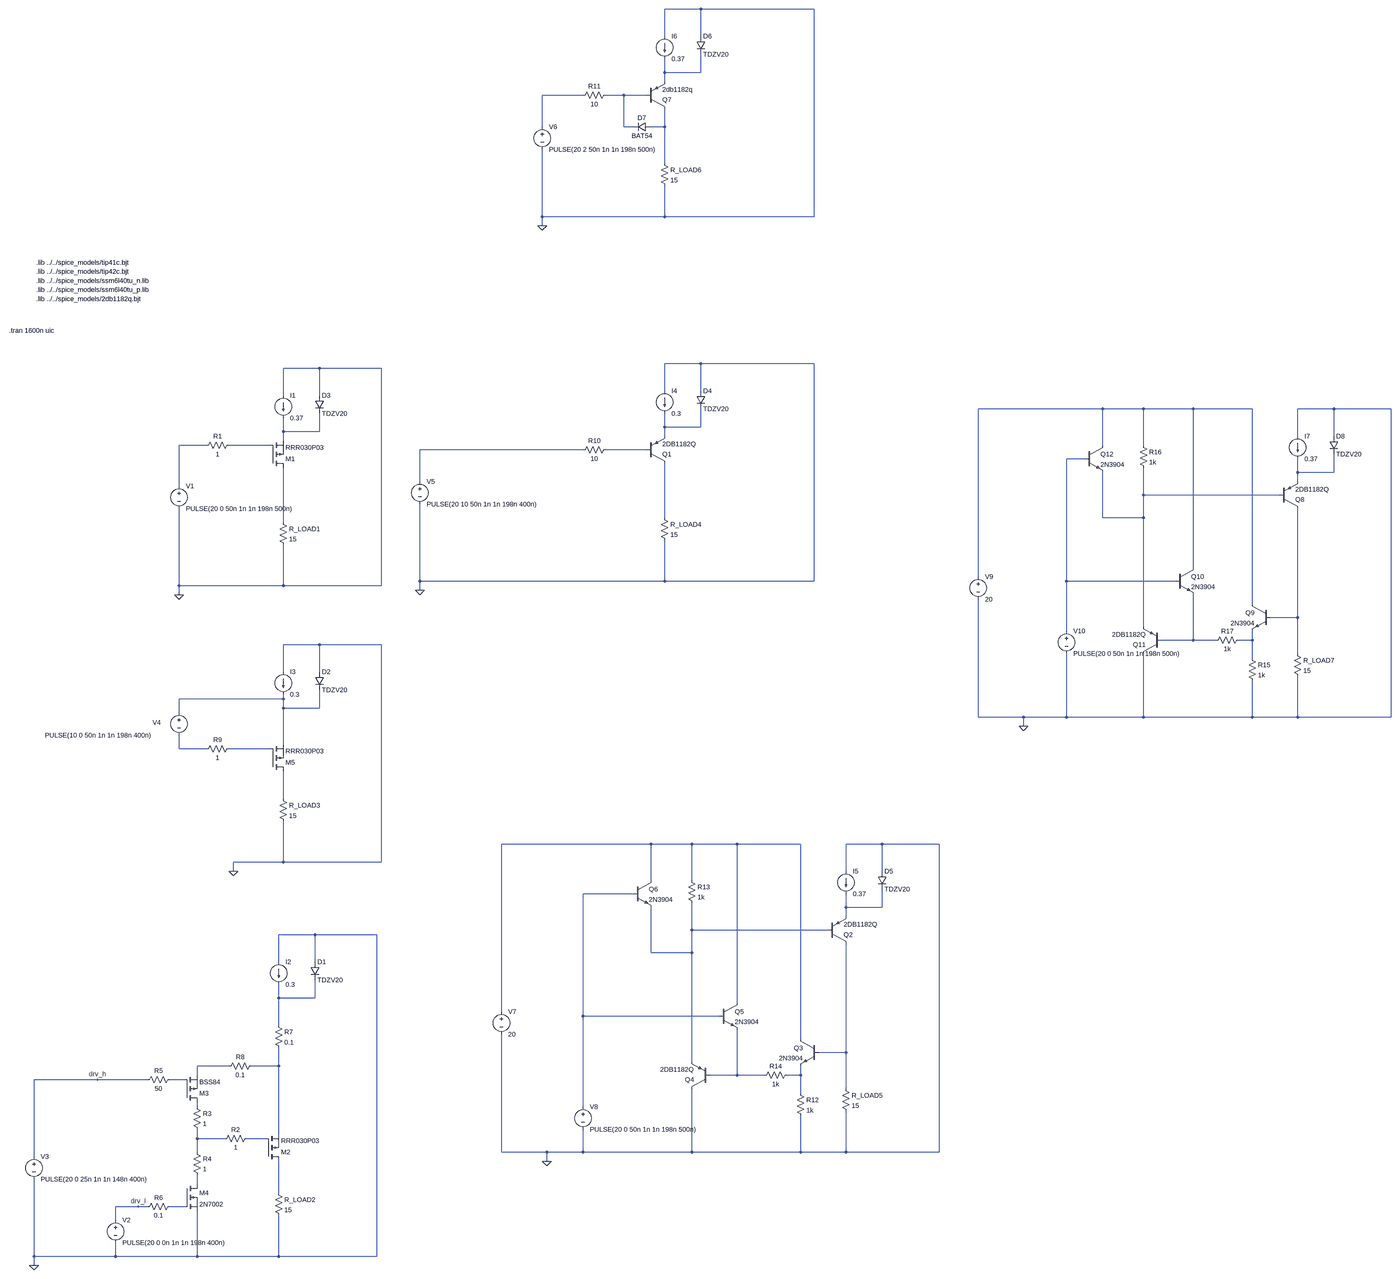
[diagram p0: schematic current_switch_test_bed.asc, whole sheet]
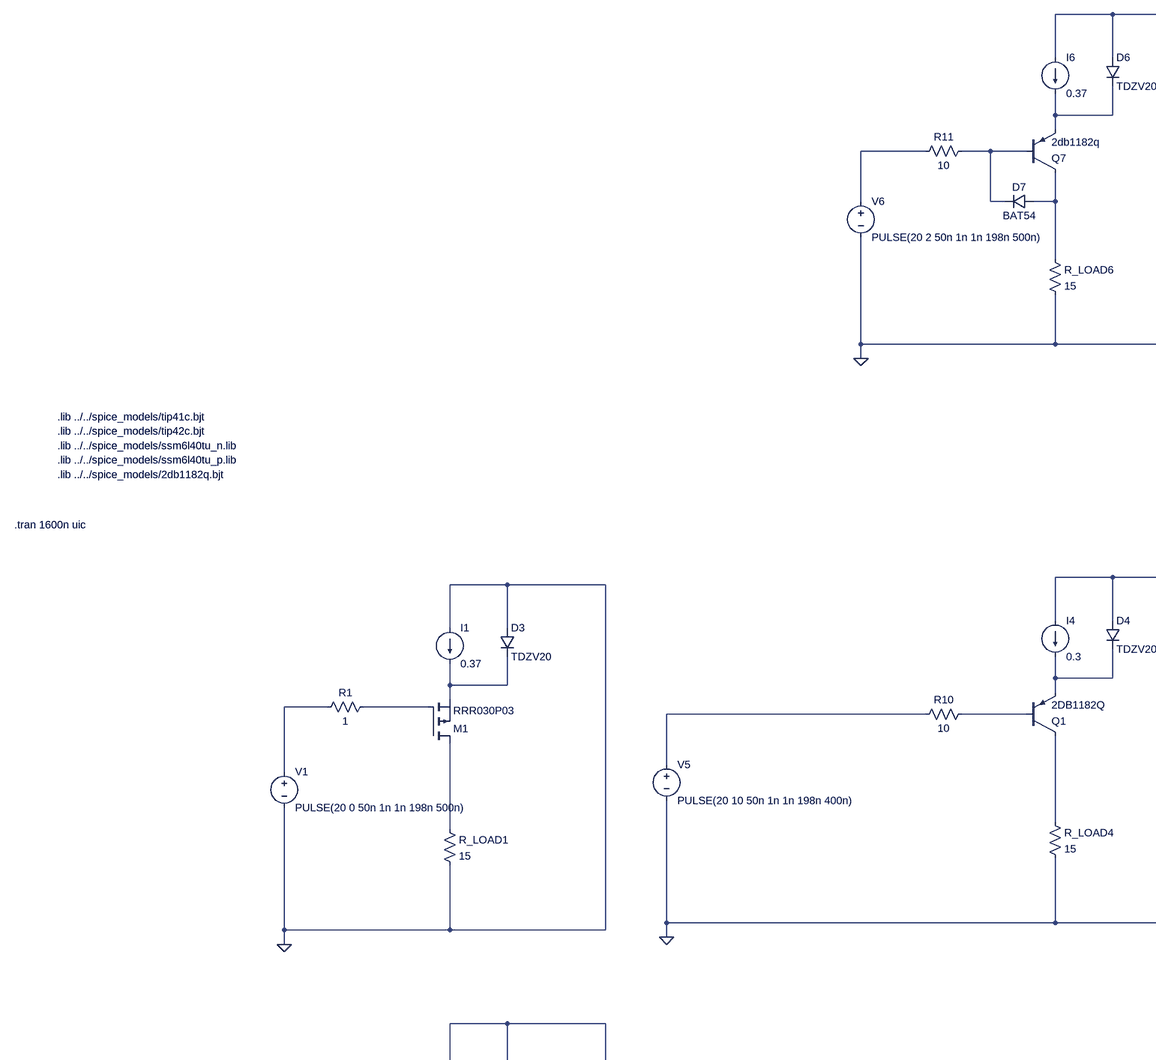
[diagram p1: schematic current_switch_test_bed.asc, part, row 1 of 2, column 1 of 2]
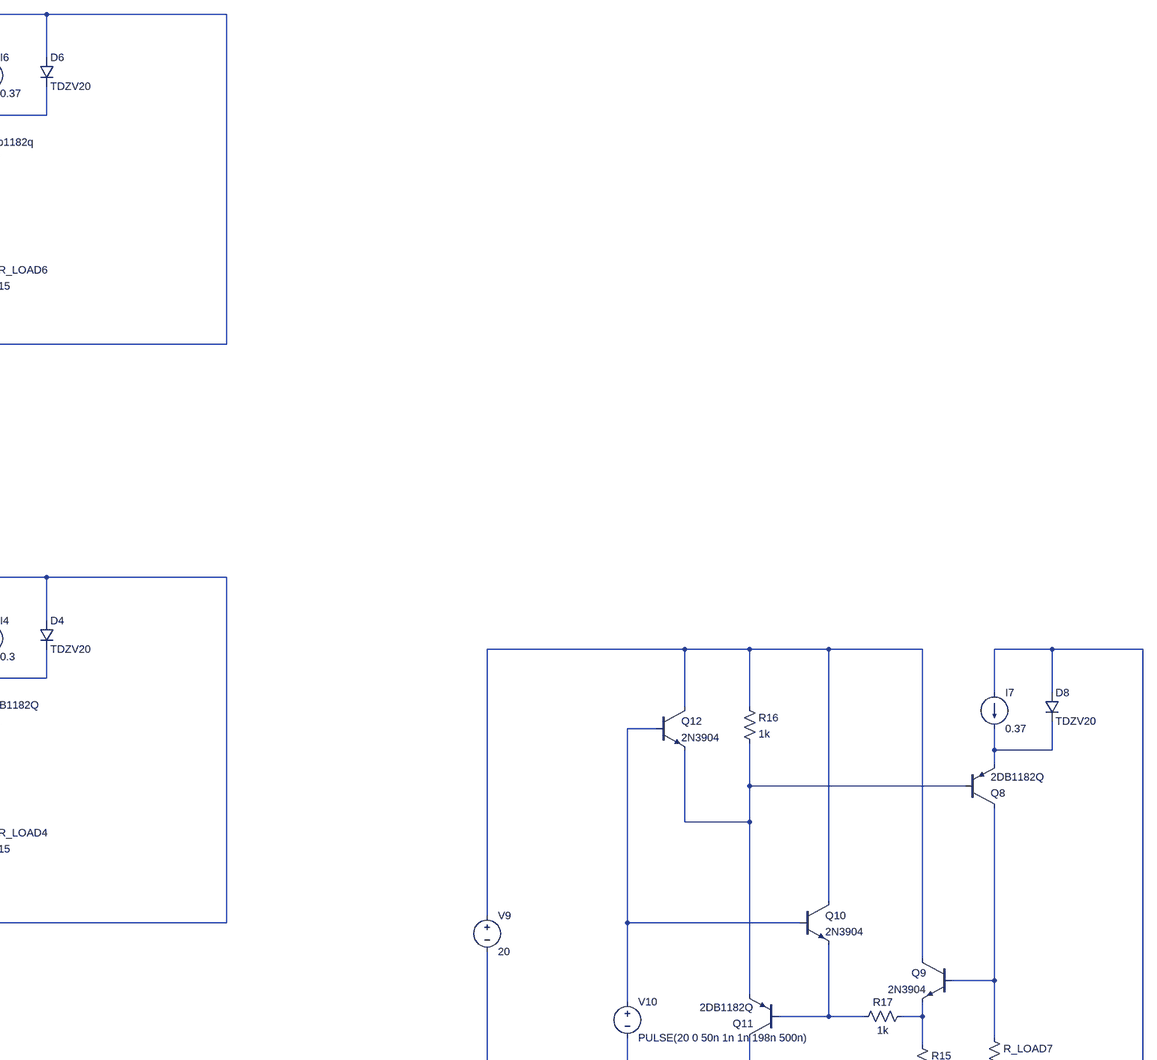
[diagram p2: schematic current_switch_test_bed.asc, part, row 1 of 2, column 2 of 2]
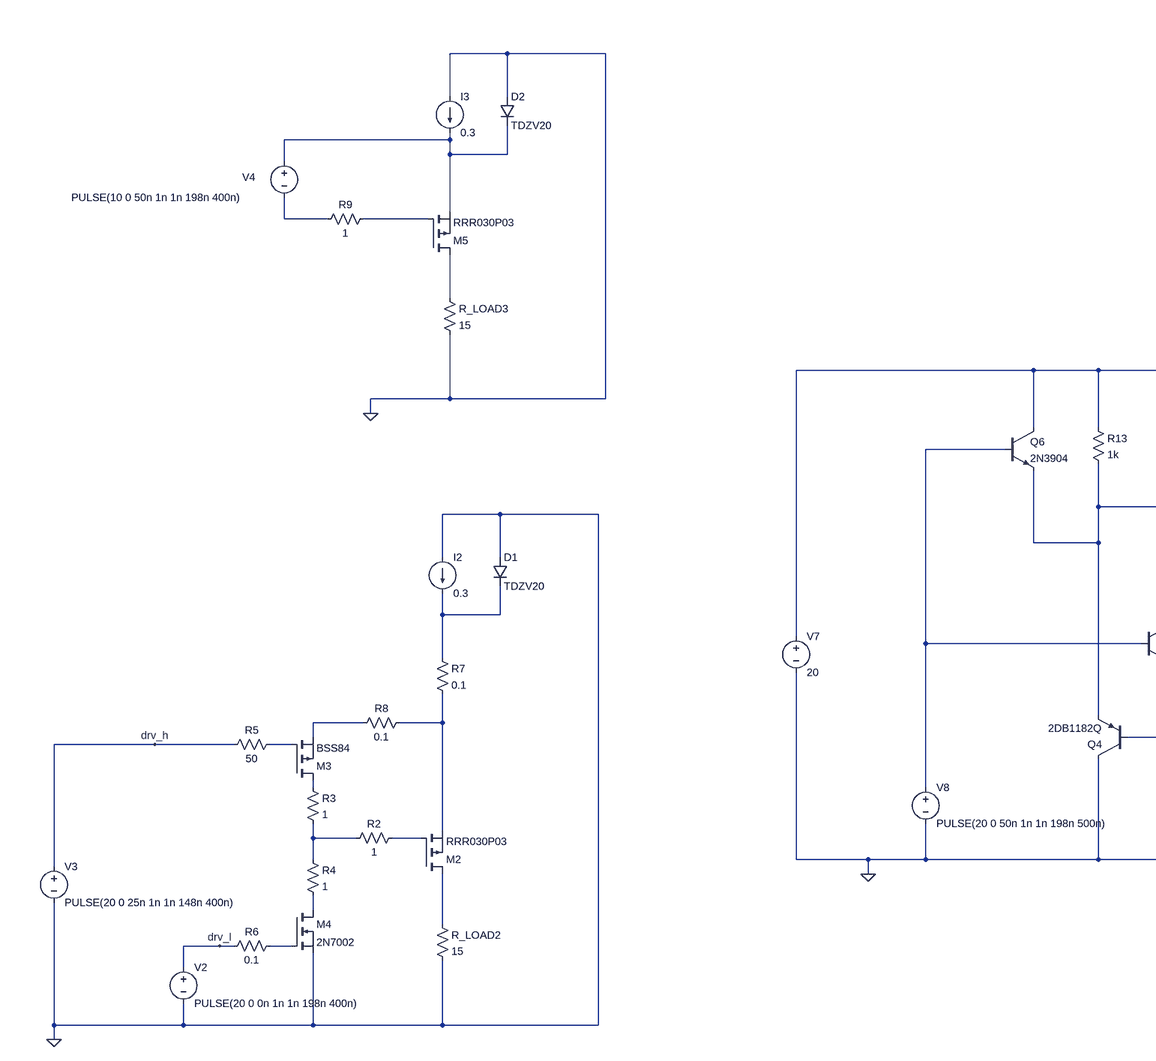
[diagram p3: schematic current_switch_test_bed.asc, part, row 2 of 2, column 1 of 2]
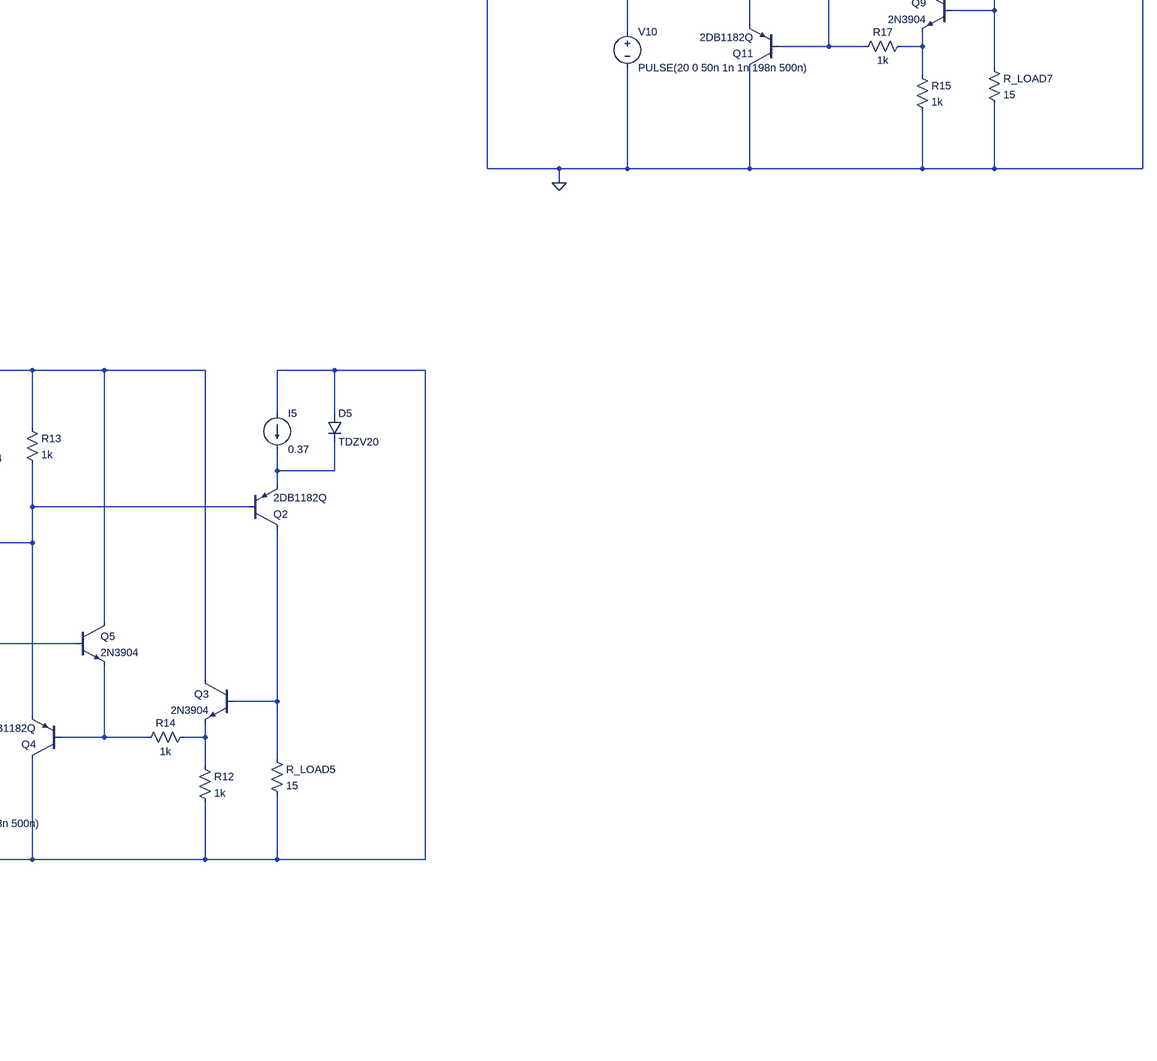
[diagram p4: schematic current_switch_test_bed.asc, part, row 2 of 2, column 2 of 2]
current_switch_test_bed.asc, the LTspice schematic file:
Version 4.1
SHEET 1 5828 2404
WIRE 2208 -2192 2080 -2192
WIRE 2608 -2192 2208 -2192
WIRE 2080 -2096 2080 -2192
WIRE 2208 -2096 2208 -2192
WIRE 2080 -1968 2080 -2016
WIRE 2208 -1968 2208 -2032
WIRE 2208 -1968 2080 -1968
WIRE 2080 -1936 2080 -1968
WIRE 1792 -1888 1648 -1888
WIRE 1936 -1888 1872 -1888
WIRE 2016 -1888 1936 -1888
WIRE 1648 -1776 1648 -1888
WIRE 1936 -1776 1936 -1888
WIRE 1968 -1776 1936 -1776
WIRE 2080 -1776 2080 -1840
WIRE 2080 -1776 2032 -1776
WIRE 2080 -1648 2080 -1776
WIRE 1648 -1424 1648 -1696
WIRE 2080 -1424 2080 -1568
WIRE 2080 -1424 1648 -1424
WIRE 2608 -1424 2608 -2192
WIRE 2608 -1424 2080 -1424
WIRE 1648 -1392 1648 -1424
WIRE 2208 -800 2080 -800
WIRE 2608 -800 2208 -800
WIRE 432 -784 304 -784
WIRE 832 -784 432 -784
WIRE 2080 -704 2080 -800
WIRE 2208 -704 2208 -800
WIRE 304 -688 304 -784
WIRE 432 -688 432 -784
WIRE 4608 -640 4080 -640
WIRE 4752 -640 4608 -640
WIRE 4928 -640 4752 -640
WIRE 5136 -640 4928 -640
WIRE 5424 -640 5296 -640
WIRE 5824 -640 5424 -640
WIRE 2080 -576 2080 -624
WIRE 2208 -576 2208 -640
WIRE 2208 -576 2080 -576
WIRE 304 -560 304 -608
WIRE 432 -560 432 -624
WIRE 432 -560 304 -560
WIRE 2080 -544 2080 -576
WIRE 5296 -544 5296 -640
WIRE 5424 -544 5424 -640
WIRE 304 -528 304 -560
WIRE 32 -512 -64 -512
WIRE 256 -512 112 -512
WIRE 4608 -512 4608 -640
WIRE 4752 -512 4752 -640
WIRE 1792 -496 1216 -496
WIRE 2016 -496 1872 -496
WIRE 4544 -464 4480 -464
WIRE 5296 -416 5296 -464
WIRE 5424 -416 5424 -480
WIRE 5424 -416 5296 -416
WIRE 1216 -384 1216 -496
WIRE 5296 -384 5296 -416
WIRE -64 -368 -64 -512
WIRE 4752 -336 4752 -432
WIRE 5232 -336 4752 -336
WIRE 2080 -256 2080 -448
WIRE 4608 -256 4608 -416
WIRE 4752 -256 4752 -336
WIRE 4752 -256 4608 -256
WIRE 304 -240 304 -432
WIRE 4928 -80 4928 -640
WIRE 4080 -48 4080 -640
WIRE 1216 -32 1216 -304
WIRE 2080 -32 2080 -176
WIRE 2080 -32 1216 -32
WIRE 2608 -32 2608 -800
WIRE 2608 -32 2080 -32
WIRE 4480 -32 4480 -464
WIRE 4864 -32 4480 -32
WIRE -64 -16 -64 -288
WIRE 304 -16 304 -160
WIRE 304 -16 -64 -16
WIRE 832 -16 832 -784
WIRE 832 -16 304 -16
WIRE 1216 0 1216 -32
WIRE -64 16 -64 -16
WIRE 5136 48 5136 -640
WIRE 5296 96 5296 -288
WIRE 5296 96 5200 96
WIRE 4752 128 4752 -256
WIRE 4480 144 4480 -32
WIRE 4928 176 4928 16
WIRE 4928 176 4816 176
WIRE 5008 176 4928 176
WIRE 5136 176 5136 144
WIRE 5136 176 5088 176
WIRE 432 192 304 192
WIRE 832 192 432 192
WIRE 5296 224 5296 96
WIRE 5136 240 5136 176
WIRE 304 288 304 192
WIRE 432 288 432 192
WIRE 304 384 304 368
WIRE 304 384 -64 384
WIRE 304 416 304 384
WIRE 432 416 432 352
WIRE 432 416 304 416
WIRE -64 432 -64 384
WIRE 4080 448 4080 32
WIRE 4240 448 4080 448
WIRE 4480 448 4480 224
WIRE 4480 448 4240 448
WIRE 4752 448 4752 224
WIRE 4752 448 4480 448
WIRE 5136 448 5136 320
WIRE 5136 448 4752 448
WIRE 5296 448 5296 304
WIRE 5296 448 5136 448
WIRE 5824 448 5824 -640
WIRE 5824 448 5296 448
WIRE 4240 480 4240 448
WIRE 304 544 304 416
WIRE -64 560 -64 512
WIRE 32 560 -64 560
WIRE 256 560 112 560
WIRE 304 736 304 640
WIRE 2032 896 1504 896
WIRE 2176 896 2032 896
WIRE 2336 896 2176 896
WIRE 2560 896 2336 896
WIRE 2848 896 2720 896
WIRE 3248 896 2848 896
WIRE 304 960 304 816
WIRE 304 960 128 960
WIRE 832 960 832 192
WIRE 832 960 304 960
WIRE 128 992 128 960
WIRE 2720 992 2720 896
WIRE 2848 992 2848 896
WIRE 2032 1024 2032 896
WIRE 2176 1024 2176 896
WIRE 1968 1072 1792 1072
WIRE 2720 1120 2720 1072
WIRE 2848 1120 2848 1056
WIRE 2848 1120 2720 1120
WIRE 2720 1152 2720 1120
WIRE 2176 1200 2176 1104
WIRE 2656 1200 2176 1200
WIRE 416 1216 288 1216
WIRE 816 1216 416 1216
WIRE 2032 1280 2032 1120
WIRE 2176 1280 2176 1200
WIRE 2176 1280 2032 1280
WIRE 288 1312 288 1216
WIRE 416 1312 416 1216
WIRE 288 1440 288 1392
WIRE 416 1440 416 1376
WIRE 416 1440 288 1440
WIRE 2336 1456 2336 896
WIRE 1504 1488 1504 896
WIRE 1792 1504 1792 1072
WIRE 2272 1504 1792 1504
WIRE 288 1536 288 1440
WIRE 2560 1584 2560 896
WIRE 2720 1632 2720 1248
WIRE 2720 1632 2624 1632
WIRE 2176 1664 2176 1280
WIRE 112 1680 0 1680
WIRE 288 1680 288 1616
WIRE 288 1680 192 1680
WIRE 0 1712 0 1680
WIRE 2336 1712 2336 1552
WIRE 2336 1712 2240 1712
WIRE 2432 1712 2336 1712
WIRE 2560 1712 2560 1680
WIRE 2560 1712 2512 1712
WIRE -352 1728 -576 1728
WIRE -176 1728 -352 1728
WIRE -48 1728 -96 1728
WIRE 2720 1760 2720 1632
WIRE 2560 1776 2560 1712
WIRE 0 1824 0 1808
WIRE 1792 1824 1792 1504
WIRE 288 1920 288 1680
WIRE 0 1936 0 1904
WIRE 96 1936 0 1936
WIRE 240 1936 176 1936
WIRE 0 1984 0 1936
WIRE 1504 1984 1504 1568
WIRE 1664 1984 1504 1984
WIRE 1792 1984 1792 1904
WIRE 1792 1984 1664 1984
WIRE 2176 1984 2176 1760
WIRE 2176 1984 1792 1984
WIRE 2560 1984 2560 1856
WIRE 2560 1984 2176 1984
WIRE 2720 1984 2720 1840
WIRE 2720 1984 2560 1984
WIRE 3248 1984 3248 896
WIRE 3248 1984 2720 1984
WIRE -576 2000 -576 1728
WIRE 1664 2016 1664 1984
WIRE 0 2096 0 2064
WIRE 288 2128 288 2016
WIRE -208 2176 -288 2176
WIRE -176 2176 -208 2176
WIRE -48 2176 -96 2176
WIRE -288 2224 -288 2176
WIRE -576 2352 -576 2080
WIRE -288 2352 -288 2304
WIRE -288 2352 -576 2352
WIRE 0 2352 0 2192
WIRE 0 2352 -288 2352
WIRE 288 2352 288 2208
WIRE 288 2352 0 2352
WIRE 816 2352 816 1216
WIRE 816 2352 288 2352
WIRE -576 2384 -576 2352
FLAG -64 16 0
FLAG -576 2384 0
FLAG -352 1728 drv_h
FLAG -208 2176 drv_l
FLAG 128 992 0
FLAG 1216 0 0
FLAG 1664 2016 0
FLAG 1648 -1392 0
FLAG 4240 480 0
SYMBOL res 288 -256 R0
SYMATTR InstName R_LOAD1
SYMATTR Value 15
SYMBOL res 128 -528 R90
WINDOW 0 0 56 VBottom 2
WINDOW 3 32 56 VTop 2
SYMATTR InstName R1
SYMATTR Value 1
SYMBOL pmos 256 -432 M180
SYMATTR InstName M1
SYMATTR Value RRR030P03
SYMBOL diode 416 -688 R0
SYMATTR InstName D3
SYMATTR Value TDZV20
SYMBOL current 304 -688 R0
SYMATTR InstName I1
SYMATTR Value 0.37
SYMBOL voltage -64 -384 R0
WINDOW 123 0 0 Left 0
WINDOW 39 0 0 Left 0
SYMATTR InstName V1
SYMATTR Value PULSE(20 0 50n 1n 1n 198n 500n)
SYMBOL res 272 2112 R0
SYMATTR InstName R_LOAD2
SYMATTR Value 15
SYMBOL res 80 1952 R270
WINDOW 0 32 56 VTop 2
WINDOW 3 0 56 VBottom 2
SYMATTR InstName R2
SYMATTR Value 1
SYMBOL pmos 240 2016 M180
SYMATTR InstName M2
SYMATTR Value RRR030P03
SYMBOL diode 400 1312 R0
SYMATTR InstName D1
SYMATTR Value TDZV20
SYMBOL current 288 1312 R0
SYMATTR InstName I2
SYMATTR Value 0.3
SYMBOL voltage -288 2208 R0
WINDOW 123 0 0 Left 0
WINDOW 39 0 0 Left 0
SYMATTR InstName V2
SYMATTR Value PULSE(20 0 0n 1n 1n 198n 400n)
SYMBOL pmos -48 1808 M180
SYMATTR InstName M3
SYMATTR Value BSS84
SYMBOL nmos -48 2096 R0
SYMATTR InstName M4
SYMATTR Value 2N7002
SYMBOL res -16 1808 R0
SYMATTR InstName R3
SYMATTR Value 1
SYMBOL res -16 1968 R0
SYMATTR InstName R4
SYMATTR Value 1
SYMBOL voltage -576 1984 R0
WINDOW 123 0 0 Left 0
WINDOW 39 0 0 Left 0
SYMATTR InstName V3
SYMATTR Value PULSE(20 0 25n 1n 1n 148n 400n)
SYMBOL res -80 1712 R90
WINDOW 0 0 56 VBottom 2
WINDOW 3 32 56 VTop 2
SYMATTR InstName R5
SYMATTR Value 50
SYMBOL res -80 2160 R90
WINDOW 0 0 56 VBottom 2
WINDOW 3 32 56 VTop 2
SYMATTR InstName R6
SYMATTR Value 0.1
SYMBOL res 272 1520 R0
SYMATTR InstName R7
SYMATTR Value 0.1
SYMBOL res 208 1664 R90
WINDOW 0 0 56 VBottom 2
WINDOW 3 32 56 VTop 2
SYMATTR InstName R8
SYMATTR Value 0.1
SYMBOL res 288 720 R0
SYMATTR InstName R_LOAD3
SYMATTR Value 15
SYMBOL res 128 544 R90
WINDOW 0 0 56 VBottom 2
WINDOW 3 32 56 VTop 2
SYMATTR InstName R9
SYMATTR Value 1
SYMBOL pmos 256 640 M180
SYMATTR InstName M5
SYMATTR Value RRR030P03
SYMBOL diode 416 288 R0
SYMATTR InstName D2
SYMATTR Value TDZV20
SYMBOL current 304 288 R0
SYMATTR InstName I3
SYMATTR Value 0.3
SYMBOL voltage -64 416 R0
WINDOW 0 -93 51 Left 2
WINDOW 3 -473 96 Left 2
WINDOW 123 0 0 Left 0
WINDOW 39 0 0 Left 0
SYMATTR InstName V4
SYMATTR Value PULSE(10 0 50n 1n 1n 198n 400n)
SYMBOL pnp 2016 -448 M180
SYMATTR InstName Q1
SYMATTR Value 2DB1182Q
SYMBOL res 2064 -272 R0
SYMATTR InstName R_LOAD4
SYMATTR Value 15
SYMBOL res 1888 -512 R90
WINDOW 0 0 56 VBottom 2
WINDOW 3 32 56 VTop 2
SYMATTR InstName R10
SYMATTR Value 10
SYMBOL diode 2192 -704 R0
SYMATTR InstName D4
SYMATTR Value TDZV20
SYMBOL current 2080 -704 R0
SYMATTR InstName I4
SYMATTR Value 0.3
SYMBOL voltage 1216 -400 R0
WINDOW 123 0 0 Left 0
WINDOW 39 0 0 Left 0
SYMATTR InstName V5
SYMATTR Value PULSE(20 10 50n 1n 1n 198n 400n)
SYMBOL pnp 2656 1248 M180
SYMATTR InstName Q2
SYMATTR Value 2DB1182Q
SYMBOL res 2704 1744 R0
SYMATTR InstName R_LOAD5
SYMATTR Value 15
SYMBOL diode 2832 992 R0
SYMATTR InstName D5
SYMATTR Value TDZV20
SYMBOL current 2720 992 R0
SYMATTR InstName I5
SYMATTR Value 0.37
SYMBOL npn 2624 1584 M0
SYMATTR InstName Q3
SYMATTR Value 2N3904
SYMBOL voltage 1504 1472 R0
SYMATTR InstName V7
SYMATTR Value 20
SYMBOL res 2544 1760 R0
SYMATTR InstName R12
SYMATTR Value 1k
SYMBOL res 2160 1008 R0
SYMATTR InstName R13
SYMATTR Value 1k
SYMBOL res 2528 1696 R90
WINDOW 0 0 56 VBottom 2
WINDOW 3 32 56 VTop 2
SYMATTR InstName R14
SYMATTR Value 1k
SYMBOL voltage 1792 1808 R0
WINDOW 123 0 0 Left 0
WINDOW 39 0 0 Left 0
SYMATTR InstName V8
SYMATTR Value PULSE(20 0 50n 1n 1n 198n 500n)
SYMBOL npn 2272 1456 R0
SYMATTR InstName Q5
SYMATTR Value 2N3904
SYMBOL pnp 2240 1760 R180
SYMATTR InstName Q4
SYMATTR Value 2DB1182Q
SYMBOL npn 1968 1024 R0
SYMATTR InstName Q6
SYMATTR Value 2N3904
SYMBOL pnp 2016 -1840 M180
SYMATTR InstName Q7
SYMATTR Value 2db1182q
SYMBOL res 2064 -1664 R0
SYMATTR InstName R_LOAD6
SYMATTR Value 15
SYMBOL res 1888 -1904 R90
WINDOW 0 0 56 VBottom 2
WINDOW 3 32 56 VTop 2
SYMATTR InstName R11
SYMATTR Value 10
SYMBOL diode 2192 -2096 R0
SYMATTR InstName D6
SYMATTR Value TDZV20
SYMBOL current 2080 -2096 R0
SYMATTR InstName I6
SYMATTR Value 0.37
SYMBOL voltage 1648 -1792 R0
WINDOW 123 0 0 Left 0
WINDOW 39 0 0 Left 0
SYMATTR InstName V6
SYMATTR Value PULSE(20 2 50n 1n 1n 198n 500n)
SYMBOL diode 2032 -1792 R90
WINDOW 0 0 32 VBottom 2
WINDOW 3 32 32 VTop 2
SYMATTR InstName D7
SYMATTR Value BAT54
SYMATTR Description Diode
SYMATTR Type diode
SYMBOL pnp 5232 -288 M180
SYMATTR InstName Q8
SYMATTR Value 2DB1182Q
SYMBOL res 5280 208 R0
SYMATTR InstName R_LOAD7
SYMATTR Value 15
SYMBOL diode 5408 -544 R0
SYMATTR InstName D8
SYMATTR Value TDZV20
SYMBOL current 5296 -544 R0
SYMATTR InstName I7
SYMATTR Value 0.37
SYMBOL npn 5200 48 M0
SYMATTR InstName Q9
SYMATTR Value 2N3904
SYMBOL voltage 4080 -64 R0
SYMATTR InstName V9
SYMATTR Value 20
SYMBOL res 5120 224 R0
SYMATTR InstName R15
SYMATTR Value 1k
SYMBOL res 4736 -528 R0
SYMATTR InstName R16
SYMATTR Value 1k
SYMBOL res 5104 160 R90
WINDOW 0 0 56 VBottom 2
WINDOW 3 32 56 VTop 2
SYMATTR InstName R17
SYMATTR Value 1k
SYMBOL pnp 4816 224 R180
SYMATTR InstName Q11
SYMATTR Value 2DB1182Q
SYMBOL voltage 4480 128 R0
WINDOW 123 0 0 Left 0
WINDOW 39 0 0 Left 0
SYMATTR InstName V10
SYMATTR Value PULSE(20 0 50n 1n 1n 198n 500n)
SYMBOL npn 4864 -80 R0
SYMATTR InstName Q10
SYMATTR Value 2N3904
SYMBOL npn 4544 -512 R0
SYMATTR InstName Q12
SYMATTR Value 2N3904
TEXT -664 -992 Left 2 !.tran 1600n uic
TEXT -568 -1200 Left 2 !.lib ../../spice_models/tip42c.bjt
TEXT -568 -1232 Left 2 !.lib ../../spice_models/tip41c.bjt
TEXT -568 -1168 Left 2 !.lib ../../spice_models/ssm6l40tu_n.lib
TEXT -568 -1136 Left 2 !.lib ../../spice_models/ssm6l40tu_p.lib
TEXT -568 -1104 Left 2 !.lib ../../spice_models/2db1182q.bjt

The netlist it stands for:
* current_switch_test_bed.asc
R_LOAD1 N016 0 15
R1 N009 N008 1
M1 N016 N009 N007 N007 RRR030P03
D3 0 N007 TDZV20
I1 0 N007 0.37
V1 N008 0 PULSE(20 0 50n 1n 1n 198n 500n)
R_LOAD2 N039 0 15
R2 N036 N037 1
M2 N039 N037 N031 N031 RRR030P03
D1 0 N028 TDZV20
I2 0 N028 0.3
V2 drv_l 0 PULSE(20 0 0n 1n 1n 198n 400n)
M3 N035 N034 N030 N030 BSS84
M4 N038 N040 0 0 2N7002
R3 N035 N036 1
R4 N036 N038 1
V3 drv_h 0 PULSE(20 0 25n 1n 1n 148n 400n)
R5 N034 drv_h 50
R6 N040 drv_l 0.1
R7 N028 N031 0.1
R8 N031 N030 0.1
R_LOAD3 N023 0 15
R9 N022 N021 1
M5 N023 N022 N020 N020 RRR030P03
D2 0 N020 TDZV20
I3 0 N020 0.3
V4 N020 N021 PULSE(10 0 50n 1n 1n 198n 400n)
Q1 N015 N011 N006 0 2DB1182Q
R_LOAD4 N015 0 15
R10 N011 N010 10
D4 0 N006 TDZV20
I4 0 N006 0.3
V5 N010 0 PULSE(20 10 50n 1n 1n 198n 400n)
Q2 N029 N027 N026 0 2DB1182Q
R_LOAD5 N029 0 15
D5 0 N026 TDZV20
I5 0 N026 0.37
Q3 N024 N029 N033 0 2N3904
V7 N024 0 20
R12 N033 0 1k
R13 N024 N027 1k
R14 N033 N032 1k
V8 N025 0 PULSE(20 0 50n 1n 1n 198n 500n)
Q5 N024 N025 N032 0 2N3904
Q4 0 N032 N027 0 2DB1182Q
Q6 N024 N025 N027 0 2N3904
Q7 N004 N003 N001 0 2db1182q
R_LOAD6 N004 0 15
R11 N003 N002 10
D6 0 N001 TDZV20
I6 0 N001 0.37
V6 N002 0 PULSE(20 2 50n 1n 1n 198n 500n)
D7 N004 N003 BAT54
Q8 N017 N014 N013 0 2DB1182Q
R_LOAD7 N017 0 15
D8 0 N013 TDZV20
I7 0 N013 0.37
Q9 N005 N017 N019 0 2N3904
V9 N005 0 20
R15 N019 0 1k
R16 N005 N014 1k
R17 N019 N018 1k
Q11 0 N018 N014 0 2DB1182Q
V10 N012 0 PULSE(20 0 50n 1n 1n 198n 500n)
Q10 N005 N012 N018 0 2N3904
Q12 N005 N012 N014 0 2N3904
.model D D
.lib standard.dio
.model NPN NPN
.model PNP PNP
.lib standard.bjt
.model NMOS NMOS
.model PMOS PMOS
.lib standard.mos
.tran 1600n uic
.lib ../../spice_models/tip42c.bjt
.lib ../../spice_models/tip41c.bjt
.lib ../../spice_models/ssm6l40tu_n.lib
.lib ../../spice_models/ssm6l40tu_p.lib
.lib ../../spice_models/2db1182q.bjt
.backanno
.end